# EAGLE design ai_ardushield_lumina (EAGLE 6.5.0)
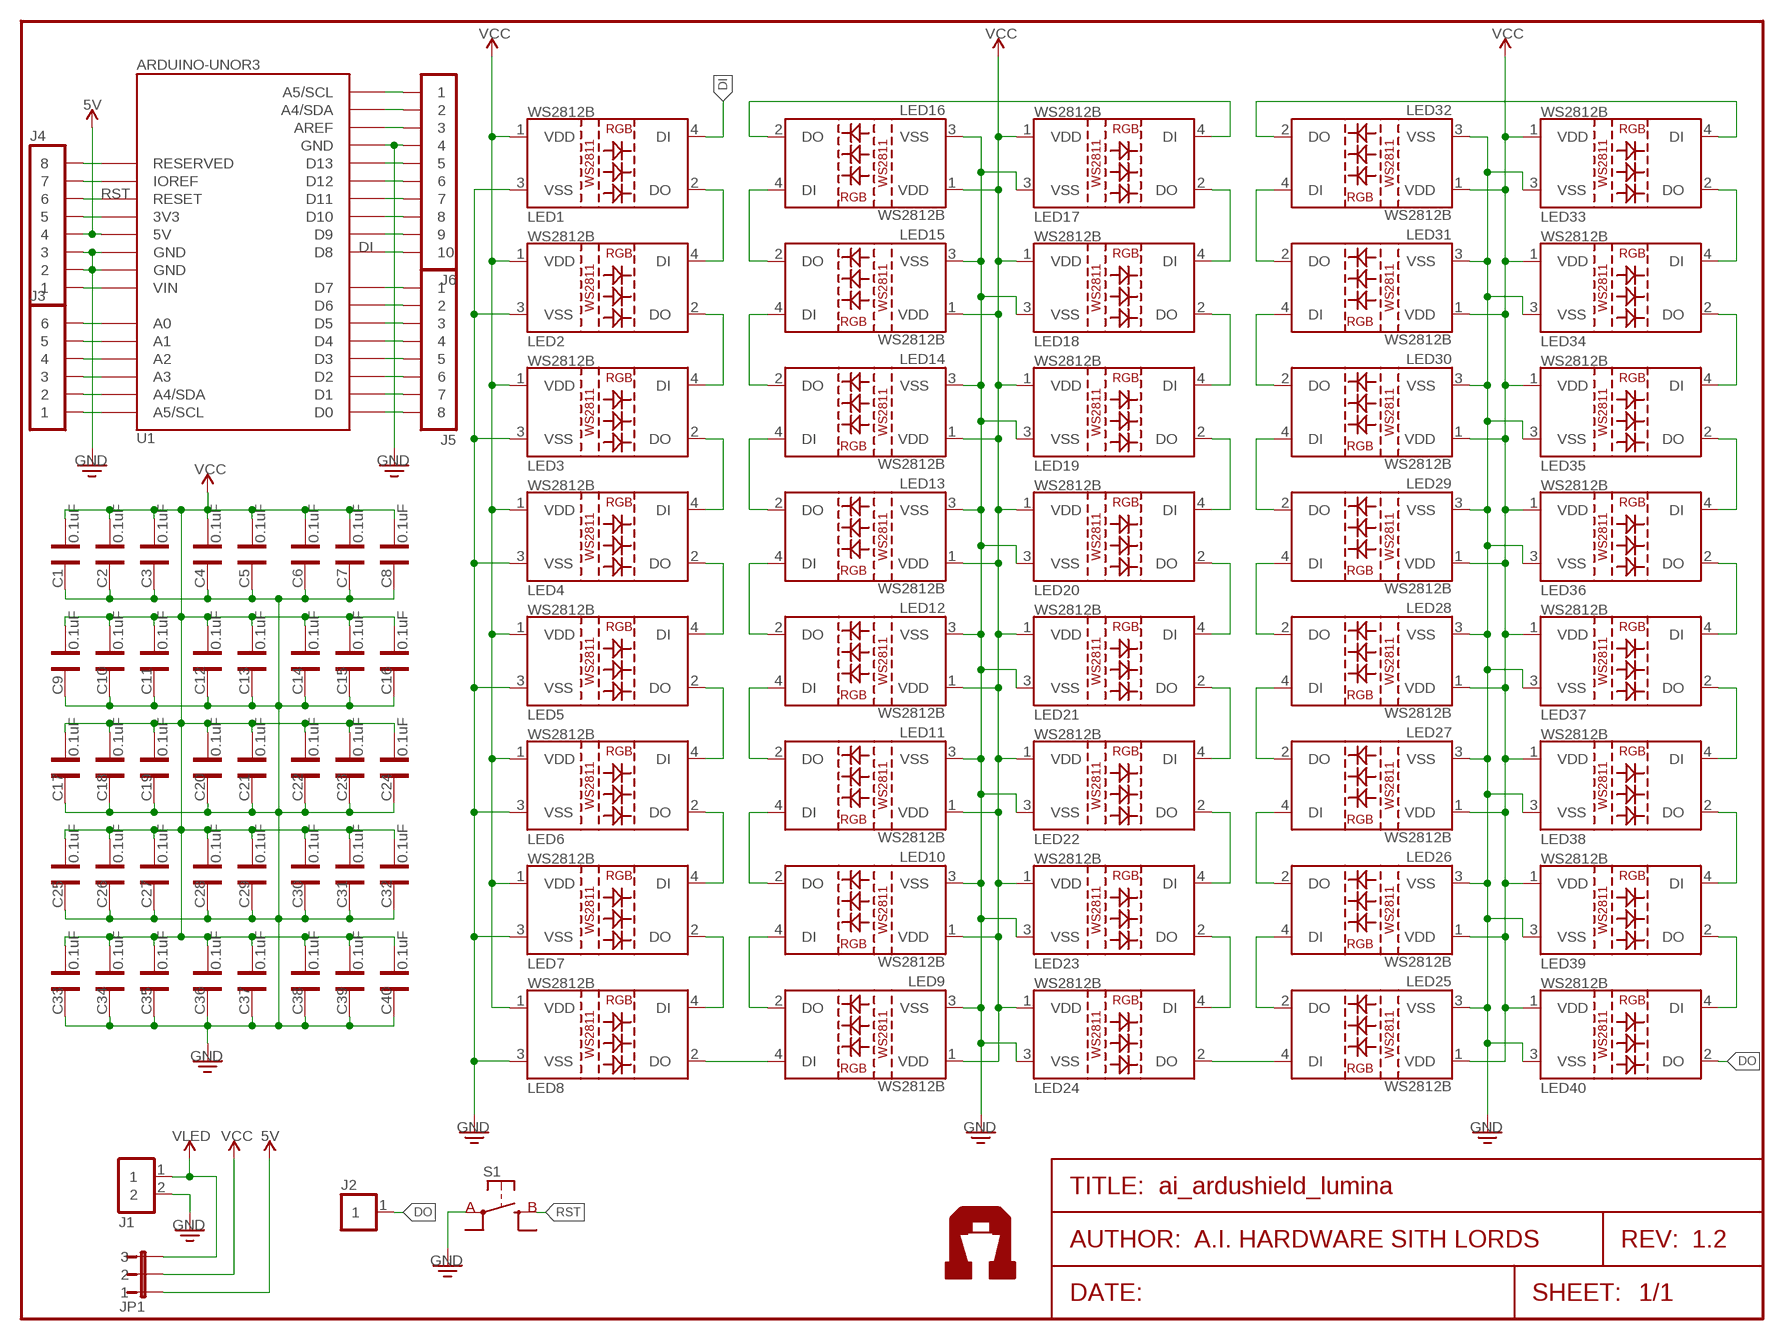
[diagram p0: schematic, sheet 1]
FRAME1 (FRAME-LETTER): AUTHOR: A.I. HARDWARE SITH LORDS; REV: 1.2

## Parts
C1  0.1uF  CAP0603  [CAP-0603]
C2  0.1uF  CAP0603  [CAP-0603]
C3  0.1uF  CAP0603  [CAP-0603]
C4  0.1uF  CAP0603  [CAP-0603]
C5  0.1uF  CAP0603  [CAP-0603]
C6  0.1uF  CAP0603  [CAP-0603]
C7  0.1uF  CAP0603  [CAP-0603]
C8  0.1uF  CAP0603  [CAP-0603]
C9  0.1uF  CAP0603  [CAP-0603]
C10  0.1uF  CAP0603  [CAP-0603]
C11  0.1uF  CAP0603  [CAP-0603]
C12  0.1uF  CAP0603  [CAP-0603]
C13  0.1uF  CAP0603  [CAP-0603]
C14  0.1uF  CAP0603  [CAP-0603]
C15  0.1uF  CAP0603  [CAP-0603]
C16  0.1uF  CAP0603  [CAP-0603]
C17  0.1uF  CAP0603  [CAP-0603]
C18  0.1uF  CAP0603  [CAP-0603]
C19  0.1uF  CAP0603  [CAP-0603]
C20  0.1uF  CAP0603  [CAP-0603]
C21  0.1uF  CAP0603  [CAP-0603]
C22  0.1uF  CAP0603  [CAP-0603]
C23  0.1uF  CAP0603  [CAP-0603]
C24  0.1uF  CAP0603  [CAP-0603]
C25  0.1uF  CAP0603  [CAP-0603]
C26  0.1uF  CAP0603  [CAP-0603]
C27  0.1uF  CAP0603  [CAP-0603]
C28  0.1uF  CAP0603  [CAP-0603]
C29  0.1uF  CAP0603  [CAP-0603]
C30  0.1uF  CAP0603  [CAP-0603]
C31  0.1uF  CAP0603  [CAP-0603]
C32  0.1uF  CAP0603  [CAP-0603]
C33  0.1uF  CAP0603  [CAP-0603]
C34  0.1uF  CAP0603  [CAP-0603]
C35  0.1uF  CAP0603  [CAP-0603]
C36  0.1uF  CAP0603  [CAP-0603]
C37  0.1uF  CAP0603  [CAP-0603]
C38  0.1uF  CAP0603  [CAP-0603]
C39  0.1uF  CAP0603  [CAP-0603]
C40  0.1uF  CAP0603  [CAP-0603]
J1  1X02ST  [1X02-ST]
J2  1X01  [1X01]
J3  1X06  [1X06]
J4  1X08  [1X08]
J5  1X08  [1X08]
J6  1X10  [1X10]
JP1  1X03-PJ  [1X03]
LED1  LED-WS2812B  [LED-WS2812B]
LED2  LED-WS2812B  [LED-WS2812B]
LED3  LED-WS2812B  [LED-WS2812B]
LED4  LED-WS2812B  [LED-WS2812B]
LED5  LED-WS2812B  [LED-WS2812B]
LED6  LED-WS2812B  [LED-WS2812B]
LED7  LED-WS2812B  [LED-WS2812B]
LED8  LED-WS2812B  [LED-WS2812B]
LED9  LED-WS2812B  [LED-WS2812B]
LED10  LED-WS2812B  [LED-WS2812B]
LED11  LED-WS2812B  [LED-WS2812B]
LED12  LED-WS2812B  [LED-WS2812B]
LED13  LED-WS2812B  [LED-WS2812B]
LED14  LED-WS2812B  [LED-WS2812B]
LED15  LED-WS2812B  [LED-WS2812B]
LED16  LED-WS2812B  [LED-WS2812B]
LED17  LED-WS2812B  [LED-WS2812B]
LED18  LED-WS2812B  [LED-WS2812B]
LED19  LED-WS2812B  [LED-WS2812B]
LED20  LED-WS2812B  [LED-WS2812B]
LED21  LED-WS2812B  [LED-WS2812B]
LED22  LED-WS2812B  [LED-WS2812B]
LED23  LED-WS2812B  [LED-WS2812B]
LED24  LED-WS2812B  [LED-WS2812B]
LED25  LED-WS2812B  [LED-WS2812B]
LED26  LED-WS2812B  [LED-WS2812B]
LED27  LED-WS2812B  [LED-WS2812B]
LED28  LED-WS2812B  [LED-WS2812B]
LED29  LED-WS2812B  [LED-WS2812B]
LED30  LED-WS2812B  [LED-WS2812B]
LED31  LED-WS2812B  [LED-WS2812B]
LED32  LED-WS2812B  [LED-WS2812B]
LED33  LED-WS2812B  [LED-WS2812B]
LED34  LED-WS2812B  [LED-WS2812B]
LED35  LED-WS2812B  [LED-WS2812B]
LED36  LED-WS2812B  [LED-WS2812B]
LED37  LED-WS2812B  [LED-WS2812B]
LED38  LED-WS2812B  [LED-WS2812B]
LED39  LED-WS2812B  [LED-WS2812B]
LED40  LED-WS2812B  [LED-WS2812B]
S1  SW-SPSTSMD06X06  [SW-SPST-SMD06X06]
U1  ARDUINOUNOR3-STRAIGHT  [UNOR3-STRAIGHT]
U$9  AI-LOGOL  [AI-LOGO-L]

## Nets
5V: J4.4 JP1.1 U1.5V
DI: J6.10 LED1.4(DI) U1.D8
DO: J2.1 LED40.2(DO)
GND: C1.2 C2.2 C3.2 C4.2 C5.2 C6.2 C7.2 C8.2 C9.2 C10.2 C11.2 C12.2 C13.2 C14.2 C15.2 C16.2 C17.2 C18.2 C19.2 C20.2 C21.2 C22.2 C23.2 C24.2 C25.2 C26.2 C27.2 C28.2 C29.2 C30.2 C31.2 C32.2 C33.2 C34.2 C35.2 C36.2 C37.2 C38.2 C39.2 C40.2 J1.2 J4.2 J4.3 J6.4 LED1.3(VSS) LED2.3(VSS) LED3.3(VSS) LED4.3(VSS) LED5.3(VSS) LED6.3(VSS) LED7.3(VSS) LED8.3(VSS) LED9.3(VSS) LED10.3(VSS) LED11.3(VSS) LED12.3(VSS) LED13.3(VSS) LED14.3(VSS) LED15.3(VSS) LED16.3(VSS) LED17.3(VSS) LED18.3(VSS) LED19.3(VSS) LED20.3(VSS) LED21.3(VSS) LED22.3(VSS) LED23.3(VSS) LED24.3(VSS) LED25.3(VSS) LED26.3(VSS) LED27.3(VSS) LED28.3(VSS) LED29.3(VSS) LED30.3(VSS) LED31.3(VSS) LED32.3(VSS) LED33.3(VSS) LED34.3(VSS) LED35.3(VSS) LED36.3(VSS) LED37.3(VSS) LED38.3(VSS) LED39.3(VSS) LED40.3(VSS) S1.A@1(A) S1.A@2(A) U1.GND@1(GND) U1.GND@2(GND) U1.GND@3(GND)
N$1: LED1.2(DO) LED2.4(DI)
N$2: LED2.2(DO) LED3.4(DI)
N$3: LED3.2(DO) LED4.4(DI)
N$4: LED4.2(DO) LED5.4(DI)
N$5: LED5.2(DO) LED6.4(DI)
N$6: LED6.2(DO) LED7.4(DI)
N$7: LED7.2(DO) LED8.4(DI)
N$8: LED8.2(DO) LED9.4(DI)
N$11: LED9.2(DO) LED10.4(DI)
N$12: LED10.2(DO) LED11.4(DI)
N$13: LED11.2(DO) LED12.4(DI)
N$14: LED12.2(DO) LED13.4(DI)
N$15: LED13.2(DO) LED14.4(DI)
N$16: LED14.2(DO) LED15.4(DI)
N$17: LED15.2(DO) LED16.4(DI)
N$18: LED16.2(DO) LED17.4(DI)
N$19: LED17.2(DO) LED18.4(DI)
N$20: LED18.2(DO) LED19.4(DI)
N$21: LED19.2(DO) LED20.4(DI)
N$22: LED20.2(DO) LED21.4(DI)
N$23: LED21.2(DO) LED22.4(DI)
N$24: LED22.2(DO) LED23.4(DI)
N$25: LED23.2(DO) LED24.4(DI)
N$26: LED24.2(DO) LED25.4(DI)
N$27: LED25.2(DO) LED26.4(DI)
N$28: LED26.2(DO) LED27.4(DI)
N$29: LED27.2(DO) LED28.4(DI)
N$30: LED28.2(DO) LED29.4(DI)
N$31: LED29.2(DO) LED30.4(DI)
N$32: LED30.2(DO) LED31.4(DI)
N$33: LED31.2(DO) LED32.4(DI)
N$34: LED32.2(DO) LED33.4(DI)
N$35: LED33.2(DO) LED34.4(DI)
N$36: LED34.2(DO) LED35.4(DI)
N$38: LED35.2(DO) LED36.4(DI)
N$40: LED36.2(DO) LED37.4(DI)
N$42: J4.8 U1.RESERVED
N$43: J4.7 U1.IOREF
N$45: J4.5 U1.3V3
N$49: J4.1 U1.VIN
N$50: J3.6 U1.A0
N$51: J3.5 U1.A1
N$52: J3.4 U1.A2
N$53: J3.3 U1.A3
N$54: J3.2 U1.A4/SDA@1(A4/SDA)
N$55: J3.1 U1.A5/SCL@1(A5/SCL)
N$56: J5.8 U1.D0
N$57: J5.7 U1.D1
N$58: J5.6 U1.D2
N$59: J5.5 U1.D3
N$60: J5.4 U1.D4
N$61: J5.3 U1.D5
N$62: J6.1 U1.A5/SCL@2(A5/SCL)
N$63: J6.2 U1.A4/SDA@2(A4/SDA)
N$64: J6.3 U1.AREF
N$66: J6.5 U1.D13
N$67: J6.6 U1.D12
N$68: J6.7 U1.D11
N$69: J6.8 U1.D10
N$70: J6.9 U1.D9
N$72: J5.1 U1.D7
N$73: J5.2 U1.D6
N$74: LED37.2(DO) LED38.4(DI)
N$75: LED38.2(DO) LED39.4(DI)
N$77: LED39.2(DO) LED40.4(DI)
RST: J4.6 S1.B@1(B) S1.B@2(B) U1.RESET
VCC: C1.1 C2.1 C3.1 C4.1 C5.1 C6.1 C7.1 C8.1 C9.1 C10.1 C11.1 C12.1 C13.1 C14.1 C15.1 C16.1 C17.1 C18.1 C19.1 C20.1 C21.1 C22.1 C23.1 C24.1 C25.1 C26.1 C27.1 C28.1 C29.1 C30.1 C31.1 C32.1 C33.1 C34.1 C35.1 C36.1 C37.1 C38.1 C39.1 C40.1 JP1.2 LED1.1(VDD) LED2.1(VDD) LED3.1(VDD) LED4.1(VDD) LED5.1(VDD) LED6.1(VDD) LED7.1(VDD) LED8.1(VDD) LED9.1(VDD) LED10.1(VDD) LED11.1(VDD) LED12.1(VDD) LED13.1(VDD) LED14.1(VDD) LED15.1(VDD) LED16.1(VDD) LED17.1(VDD) LED18.1(VDD) LED19.1(VDD) LED20.1(VDD) LED21.1(VDD) LED22.1(VDD) LED23.1(VDD) LED24.1(VDD) LED25.1(VDD) LED26.1(VDD) LED27.1(VDD) LED28.1(VDD) LED29.1(VDD) LED30.1(VDD) LED31.1(VDD) LED32.1(VDD) LED33.1(VDD) LED34.1(VDD) LED35.1(VDD) LED36.1(VDD) LED37.1(VDD) LED38.1(VDD) LED39.1(VDD) LED40.1(VDD)
VLED: J1.1 JP1.3

## Library data of the parts
C1-C40 = Ai_Passives:CAP
J1 = Ai_Connectors:1X02
J2 = Ai_Connectors:1X01
J3 = Ai_Connectors:1X06
J4 J5 = Ai_Connectors:1X08
J6 = Ai_Connectors:1X10
JP1 = Ai_Connectors:1X03-PJ
LED1-LED40 = Ai_LED:LED-WS2812B
S1 = Ai_Electromechanical:SW-SPST
U1 = Ai_Boards:ARDUINO
U$9 = Ai_Miscellany:AI-LOGO

## Board
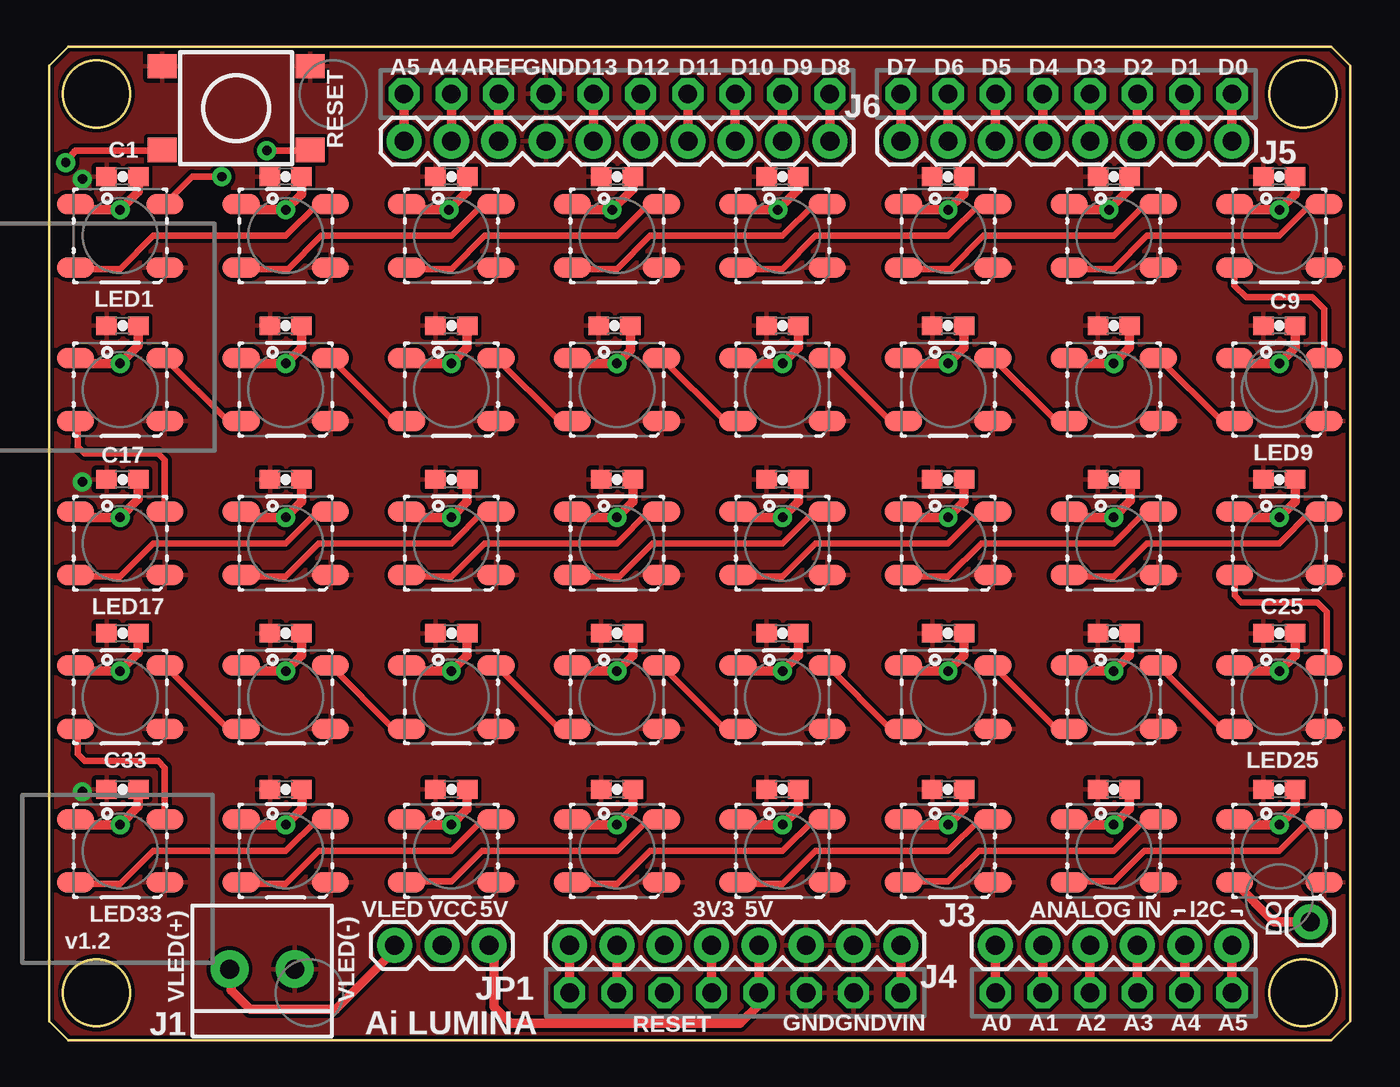
[diagram p1: board, top side]
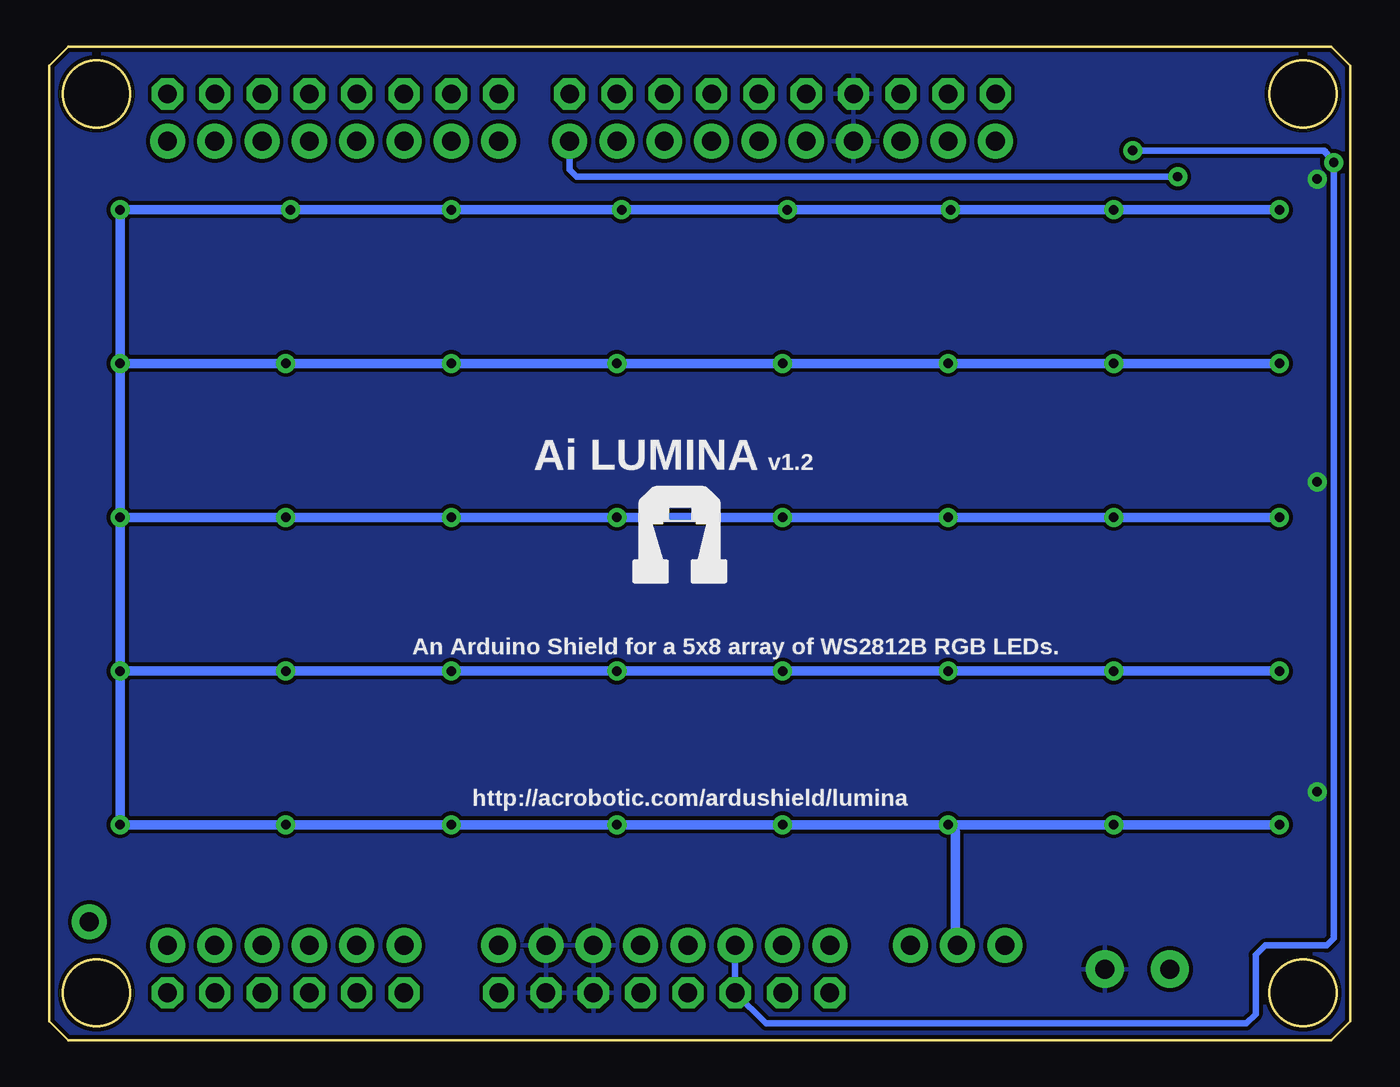
[diagram p2: board, bottom side, seen from below]

Size 69.85 x 53.34 mm. Coordinates in mm from the lower left corner, seen from the top.
Copper layers (1*16): Top 0.035mm / dielectric 1.5mm / Bottom 0.035mm
Design rules "ai_2layer": minimum track width 7mil, minimum drill 15mil, track to track 8mil, track to pad 8mil, pad to pad 8mil, via to via 8mil, smd to smd 8mil, copper to edge 8mil, drill to drill 8mil, minimum pad ring 12mil, minimum via ring 10mil, stop-mask expansion 4mil, vias tented up to drill 20mil, thermal gap 10mil

### Footprints (pad centres in the part's own frame; a part is rotated, then mirrored left to right if it is on the bottom)
CAP-0603 = smd 1.1 x 1: 1 -0.85,0; 2 0.85,0
1X02-ST = drill 1.016 pad 2.032: 1 -1.75,0; 2 1.75,0
1X01 = drill 1.016 pad 1.88: 1 0,0
1X06 = drill 1.016 pad 1.88: 1 -6.35,0; 2 -3.81,0; 3 -1.27,0; 4 1.27,0; 5 3.81,0; 6 6.35,0
1X08 = drill 1.016 pad 1.88: 1 -8.89,0; 2 -6.35,0; 3 -3.81,0; 4 -1.27,0; 5 1.27,0; 6 3.81,0; 7 6.35,0; 8 8.89,0
1X10 = drill 1.016 pad 1.88: 1 -11.43,0; 2 -8.89,0; 3 -6.35,0; 4 -3.81,0; 5 -1.27,0; 6 1.27,0; 7 3.81,0; 8 6.35,0; 9 8.89,0; 10 11.43,0
1X03 = drill 1.016 pad 1.88: 1 -2.54,0; 2 0,0; 3 2.54,0
LED-WS2812B = smd 2 x 1.1: 1 -2.4,1.7; 2 -2.4,-1.7; 3 2.4,-1.7; 4 2.4,1.7
SW-SPST-SMD06X06 = smd 1.55 x 1.3: A@1 -3.975,-2.25; A@2 3.975,-2.25; B@1 -3.975,2.25; B@2 3.975,2.25
UNOR3-STRAIGHT = drill 1 pad 1.676 octagon: 3V3 35.56,2.54; 5V 38.1,2.54; A0 50.8,2.54; A1 53.34,2.54; A2 55.88,2.54; A3 58.42,2.54; A4/SDA@1 60.96,2.54; A4/SDA@2 21.59,50.8; A5/SCL@1 63.5,2.54; A5/SCL@2 19.05,50.8; AREF 24.13,50.8; D0 63.5,50.8; D1 60.96,50.8; D2 58.42,50.8; D3 55.88,50.8; D4 53.34,50.8; D5 50.8,50.8; D6 48.26,50.8; D7 45.72,50.8; D8 41.91,50.8; D9 39.37,50.8; D10 36.83,50.8; D11 34.29,50.8; D12 31.75,50.8; D13 29.21,50.8; GND@1 43.18,2.54; GND@2 40.64,2.54; GND@3 26.67,50.8; IOREF 30.48,2.54; RESERVED 27.94,2.54; RESET 33.02,2.54; VIN 45.72,2.54

### Placement (x,y rotation side)
C1  3.94,46.35 180 top
C2  12.7,46.35 180 top
C3  21.59,46.35 180 top
C4  30.48,46.35 180 top
C5  39.37,46.35 180 top
C6  48.26,46.35 180 top
C7  57.15,46.35 180 top
C8  66.04,46.35 180 top
C9  66.04,38.35 180 top
C10  57.15,38.35 180 top
C11  48.26,38.35 180 top
C12  39.37,38.35 180 top
C13  30.35,38.35 180 top
C14  21.59,38.35 180 top
C15  12.7,38.35 180 top
C16  3.94,38.35 180 top
C17  3.94,30.1 180 top
C18  12.7,30.1 180 top
C19  21.59,30.1 180 top
C20  30.48,30.1 180 top
C21  39.37,30.1 180 top
C22  48.26,30.1 180 top
C23  57.15,30.1 180 top
C24  66.04,30.1 180 top
C25  66.04,21.84 180 top
C26  57.15,21.84 180 top
C27  48.26,21.84 180 top
C28  39.37,21.84 180 top
C29  30.48,21.84 180 top
C30  21.59,21.84 180 top
C31  12.7,21.84 180 top
C32  3.94,21.84 180 top
C33  3.94,13.46 180 top
C34  12.7,13.46 180 top
C35  21.59,13.46 180 top
C36  30.48,13.46 180 top
C37  39.37,13.46 180 top
C38  48.26,13.46 180 top
C39  57.15,13.46 180 top
C40  66.04,13.46 180 top
J1  11.43,3.81 0 top
J2  67.69,6.35 0 top
J3  57.15,5.08 180 top
J4  36.83,5.08 180 top
J5  54.61,48.26 0 top
J6  30.48,48.26 0 top
JP1  21.08,5.08 180 top
LED1  3.81,43.18 0 top
LED2  12.7,43.18 0 top
LED3  21.59,43.18 0 top
LED4  30.48,43.18 0 top
LED5  39.37,43.18 0 top
LED6  48.26,43.18 0 top
LED7  57.15,43.18 0 top
LED8  66.04,43.18 0 top
LED9  66.04,34.92 0 top
LED10  57.15,34.92 0 top
LED11  48.26,34.92 0 top
LED12  39.37,34.92 0 top
LED13  30.48,34.92 0 top
LED14  21.59,34.92 0 top
LED15  12.7,34.92 0 top
LED16  3.81,34.92 0 top
LED17  3.81,26.67 0 top
LED18  12.7,26.67 0 top
LED19  21.59,26.67 0 top
LED20  30.48,26.67 0 top
LED21  39.37,26.67 0 top
LED22  48.26,26.67 0 top
LED23  57.15,26.67 0 top
LED24  66.04,26.67 0 top
LED25  66.04,18.41 0 top
LED26  57.15,18.41 0 top
LED27  48.26,18.41 0 top
LED28  39.37,18.41 0 top
LED29  30.48,18.41 0 top
LED30  21.59,18.41 0 top
LED31  12.7,18.41 0 top
LED32  3.81,18.41 0 top
LED33  3.81,10.16 0 top
LED34  12.7,10.16 0 top
LED35  21.59,10.16 0 top
LED36  30.48,10.16 0 top
LED37  39.37,10.16 0 top
LED38  48.26,10.16 0 top
LED39  57.15,10.16 0 top
LED40  66.04,10.16 0 top
S1  10.03,50.04 180 top
U1  0,0 0 top
U$9  35.94,26.67 0 bottom

### Tracks (layer width: path | path; a pad name or v marks a point on that pad's centre or on a via)
5V
  Top 0.508: JP1.1 23.88,4.83 23.88,1.78 24.77,0.89 37.08,0.89 38.1,1.91 U1.5V J4.4
DI  (via drill 0.51)
  Top 0.356: LED1.4 7.68,46.35 v9.27,46.35
  Top 0.508: U1.D8 J6.10
  Bottom 0.356: v9.27,46.35 41.53,46.35 41.91,46.74 J6.10
DO
  Top 0.508: LED40.2 65.75,6.35 J2.1
GND  (via drill 0.51)
  other vias: 1.78,29.97 1.78,13.34 1.78,46.23
  pour Top: 0,53.34 69.85,53.34 69.85,0 0,0
  pour Bottom: 0,0 0,53.34 69.85,53.34 69.85,0
N$1
  Top 0.356: LED1.2 1.49,41.4 3.81,41.4 5.59,43.18 12.7,43.18 14.4,44.88 LED2.4
N$2
  Top 0.356: LED2.2 10.38,41.4 12.83,41.4 14.61,43.18 21.59,43.18 23.29,44.88 LED3.4
N$3
  Top 0.356: LED3.2 19.27,41.4 21.59,41.4 23.37,43.18 30.48,43.18 32.18,44.88 LED4.4
N$4
  Top 0.356: LED4.2 28.16,41.4 30.48,41.4 32.26,43.18 39.37,43.18 41.07,44.88 LED5.4
N$5
  Top 0.356: LED5.2 37.05,41.4 39.37,41.4 41.15,43.18 48.26,43.18 49.96,44.88 LED6.4
N$6
  Top 0.356: LED6.2 45.94,41.4 48.39,41.4 50.16,43.18 57.15,43.18 58.85,44.88 LED7.4
N$7
  Top 0.356: LED7.2 54.83,41.4 57.15,41.4 58.93,43.18 66.04,43.18 67.74,44.88 LED8.4
N$8
  Top 0.356: LED8.2 63.63,41.47 63.63,40.51 64.26,39.88 67.82,39.88 68.44,39.26 LED9.4
N$11
  Top 0.356: LED10.4 62.95,33.23 LED9.2
N$12
  Top 0.356: LED11.4 54.06,33.23 LED10.2
N$13
  Top 0.356: LED12.4 45.17,33.23 LED11.2
N$14
  Top 0.356: LED13.4 36.28,33.23 LED12.2
N$15
  Top 0.356: LED14.4 27.39,33.23 LED13.2
N$16
  Top 0.356: LED15.4 18.5,33.23 LED14.2
N$17
  Top 0.356: LED16.4 9.61,33.23 LED15.2
N$18
  Top 0.356: LED16.2 1.52,33.11 1.52,31.88 1.91,31.5 5.84,31.5 6.21,31.13 LED17.4
N$19
  Top 0.356: LED17.2 1.49,24.89 3.81,24.89 5.59,26.67 12.7,26.67 14.4,28.37 LED18.4
N$20
  Top 0.356: LED18.2 10.38,24.89 12.7,24.89 14.48,26.67 21.59,26.67 23.29,28.37 LED19.4
N$21
  Top 0.356: LED19.2 19.27,24.89 21.59,24.89 23.37,26.67 30.48,26.67 32.18,28.37 LED20.4
N$22
  Top 0.356: LED20.2 28.16,24.89 30.61,24.89 32.38,26.67 39.37,26.67 41.07,28.37 LED21.4
N$23
  Top 0.356: LED21.2 37.05,24.89 39.37,24.89 41.15,26.67 48.26,26.67 49.96,28.37 LED22.4
N$24
  Top 0.356: LED22.2 45.94,24.89 48.26,24.89 50.04,26.67 57.15,26.67 58.85,28.37 LED23.4
N$25
  Top 0.356: LED23.2 54.83,24.89 57.15,24.89 58.93,26.67 66.04,26.67 67.74,28.37 LED24.4
N$26
  Top 0.356: LED25.4 68.58,20.25 68.58,22.99 68.07,23.5 64.01,23.5 63.64,23.86 LED24.2
N$27
  Top 0.356: LED26.4 62.95,16.71 LED25.2
N$28
  Top 0.356: LED27.4 54.06,16.71 LED26.2
N$29
  Top 0.356: LED28.4 45.17,16.71 LED27.2
N$30
  Top 0.356: LED29.4 36.28,16.71 LED28.2
N$31
  Top 0.356: LED30.4 27.39,16.71 LED29.2
N$32
  Top 0.356: LED31.4 18.5,16.71 LED30.2
N$33
  Top 0.356: LED32.4 9.61,16.71 LED31.2
N$34
  Top 0.356: LED33.4 6.21,14.62 5.84,14.99 1.91,14.99 1.52,15.37 1.52,16.6 LED32.2
N$35
  Top 0.356: LED34.4 14.4,11.86 12.7,10.16 5.59,10.16 3.81,8.38 1.49,8.38 LED33.2
N$36
  Top 0.356: LED34.2 10.38,8.38 12.7,8.38 14.48,10.16 21.59,10.16 23.29,11.86 LED35.4
N$38
  Top 0.356: LED35.2 19.24,8.51 21.59,8.51 23.24,10.16 30.48,10.16 32.18,11.86 LED36.4
N$40
  Top 0.356: LED36.2 28.16,8.38 30.48,8.38 32.26,10.16 39.37,10.16 41.07,11.86 LED37.4
N$42
  Top 0.508: J4.8 U1.RESERVED
N$43
  Top 0.508: J4.7 U1.IOREF
N$45
  Top 0.508: J4.5 U1.3V3
N$49
  Top 0.508: J4.1 U1.VIN
N$50
  Top 0.508: J3.6 U1.A0
N$51
  Top 0.508: J3.5 U1.A1
N$52
  Top 0.508: J3.4 U1.A2
N$53
  Top 0.508: J3.3 U1.A3
N$54
  Top 0.508: J3.2 U1.A4/SDA@1
N$55
  Top 0.508: J3.1 U1.A5/SCL@1
N$56
  Top 0.508: U1.D0 J5.8
N$57
  Top 0.508: U1.D1 J5.7
N$58
  Top 0.508: U1.D2 J5.6
N$59
  Top 0.508: U1.D3 J5.5
N$60
  Top 0.508: U1.D4 J5.4
N$61
  Top 0.508: U1.D5 J5.3
N$62
  Top 0.508: J6.1 U1.A5/SCL@2
N$63
  Top 0.508: J6.2 U1.A4/SDA@2
N$64
  Top 0.508: U1.AREF J6.3
N$66
  Top 0.508: U1.D13 J6.5
N$67
  Top 0.508: U1.D12 J6.6
N$68
  Top 0.508: U1.D11 J6.7
N$69
  Top 0.508: U1.D10 J6.8
N$70
  Top 0.508: U1.D9 J6.9
N$72
  Top 0.508: U1.D7 J5.1
N$73
  Top 0.508: U1.D6 J5.2
N$74
  Top 0.356: LED37.2 37.05,8.38 39.37,8.38 41.15,10.16 48.26,10.16 49.96,11.86 LED38.4
N$75
  Top 0.356: LED38.2 45.91,8.51 48.26,8.51 49.91,10.16 57.15,10.16 58.85,11.86 LED39.4
N$77
  Top 0.356: LED39.2 54.8,8.51 57.15,8.51 58.8,10.16 66.04,10.16 67.74,11.86 LED40.4
RST  (via drill 0.51)
  Top 0.356: S1.B@1 13.97,47.75 v11.68,47.75 | S1.B@2 6.02,47.75 1.4,47.75 v0.89,47.12
  Bottom 0.356: v11.68,47.75 1.4,47.75 v0.89,47.12 0.89,5.46 1.27,5.08 4.57,5.08 5.08,4.57 5.08,1.4 5.59,0.89 31.37,0.89 U1.RESET J4.6
VCC  (via drill 0.51)
  Top 0.508: LED33.1 1.71,11.56 v3.81,11.56 4.79,12.53 C33.1 | C40.1 66.89,12.41 v66.04,11.56 63.94,11.56 LED40.1 | C34.1 13.59,13.42 13.59,12.45 v12.7,11.56 10.6,11.56 LED34.1 | C35.1 22.44,12.41 v21.59,11.56 19.49,11.56 LED35.1 | C36.1 31.33,12.41 v30.48,11.56 28.38,11.56 LED36.1 | C37.1 40.22,12.41 v39.37,11.56 37.27,11.56 LED37.1 | C38.1 49.11,12.41 v48.26,11.56 46.16,11.56 LED38.1 45.68,11.68 | C39.1 58,12.41 v57.15,11.56 55.05,11.56 LED39.1 | LED32.1 1.71,19.81 v3.81,19.81 4.79,20.79 C32.1 | C25.1 66.89,20.66 v66.04,19.81 63.94,19.81 LED25.1 | LED31.1 10.6,19.81 v12.7,19.81 13.55,20.66 C31.1 | LED30.1 19.49,19.81 v21.59,19.81 22.44,20.66 C30.1 | LED29.1 28.38,19.81 v30.48,19.81 31.33,20.66 C29.1 | LED28.1 37.27,19.81 v39.37,19.81 40.22,20.66 C28.1 | LED27.1 46.16,19.81 v48.26,19.81 49.11,20.66 C27.1 | LED26.1 55.05,19.81 v57.15,19.81 58,20.66 C26.1 | LED17.1 1.71,28.07 v3.81,28.07 4.79,29.04 C17.1 | LED24.1 63.94,28.07 v66.04,28.07 66.89,28.92 C24.1 | LED16.1 1.71,36.32 v3.81,36.32 4.79,37.3 C16.1 | LED9.1 63.94,36.32 v66.04,36.32 66.89,37.17 C9.1 | LED1.1 1.71,44.58 v3.81,44.58 4.79,45.55 C1.1 | LED8.1 63.94,44.58 v66.04,44.58 66.89,45.43 C8.1 | LED18.1 10.6,28.07 v12.7,28.07 13.55,28.92 C18.1 | LED19.1 19.49,28.07 v21.59,28.07 22.44,28.92 C19.1 | LED20.1 28.38,28.07 v30.48,28.07 31.33,28.92 C20.1 | LED21.1 37.27,28.07 v39.37,28.07 40.22,28.92 C21.1 | LED22.1 46.16,28.07 v48.26,28.07 49.11,28.92 C22.1 | C23.1 58.04,30.06 58.04,28.96 v57.15,28.07 55.05,28.07 LED23.1 | LED15.1 10.6,36.32 v12.7,36.32 13.55,37.17 C15.1 | LED14.1 19.49,36.32 v21.59,36.32 22.44,37.17 C14.1 | LED13.1 28.38,36.32 v30.48,36.32 31.2,37.05 C13.1
  Top 0.508: LED12.1 37.27,36.32 v39.37,36.32 40.22,37.17 C12.1 | LED11.1 46.16,36.32 v48.26,36.32 49.11,37.17 C11.1 | LED10.1 55.05,36.32 v57.15,36.32 58,37.17 C10.1 | LED7.1 55.05,44.58 v56.9,44.58 58,45.68 C7.1 | LED6.1 46.16,44.58 v48.26,44.58 49.11,45.43 C6.1 | LED5.1 37.27,44.58 v39.12,44.58 40.22,45.68 C5.1 | LED4.1 28.38,44.58 v30.23,44.58 31.33,45.68 C4.1 | LED3.1 19.49,44.58 v21.46,44.58 22.44,45.55 C3.1 | LED2.1 10.6,44.58 v12.7,44.58 13.55,45.43 C2.1
  Bottom 0.508: JP1.2 21.21,5.21 21.21,11.18 v21.59,11.56 | v3.81,19.81 v12.7,19.81 v21.59,19.81 v30.48,19.81 v39.37,19.81 v48.26,19.81 v57.15,19.81 v66.04,19.81 | v66.04,19.81 v66.04,11.56 v57.15,11.56 v48.26,11.56 v39.37,11.56 v30.48,11.56 v21.59,11.56 | v3.81,11.56 v12.7,11.56 v21.59,11.56 | v3.81,28.07 v12.7,28.07 v21.59,28.07 v30.48,28.07 v39.37,28.07 v48.26,28.07 v57.15,28.07 v66.04,28.07 | v3.81,36.32 v12.7,36.32 v21.59,36.32 v30.48,36.32 v39.37,36.32 v48.26,36.32 v57.15,36.32 v66.04,36.32 | v3.81,44.58 v12.7,44.58 v21.46,44.58 v30.23,44.58 v39.12,44.58 v48.26,44.58 v56.9,44.58 v66.04,44.58 v66.04,36.32 | v66.04,28.07 v66.04,19.81 | v66.04,36.32 v66.04,28.07
VLED
  Top 0.508: J1.1 9.78,3.71 9.78,2.67 10.79,1.65 15.37,1.65 18.54,4.83 JP1.3

### Text on the board
tPlace: RESET | A5 | A4 | AREF | GND | D13 | D12 | D11 | D10 | D9 | D8 | D7 | D6 | D5 | D4 | D3 | D2 | D1 | D0 | C1 | LED1 | C9 | C17 | LED9 | LED17 | C25 | C33 | LED25 | VLED | VCC | 5V | 3V3 | 5V | ANALOG IN | I2C | LED33 | DO | v1.2 | VLED(+) | VLED(-) | GND | GND | VIN | A0 | A1 | A2 | A3 | A4 | A5 | Ai LUMINA | RESET
bNames: Ai LUMINA | v1.2 | An Arduino Shield for a 5x8 array of WS2812B RGB LEDs. | http://acrobotic.com/ardushield/lumina